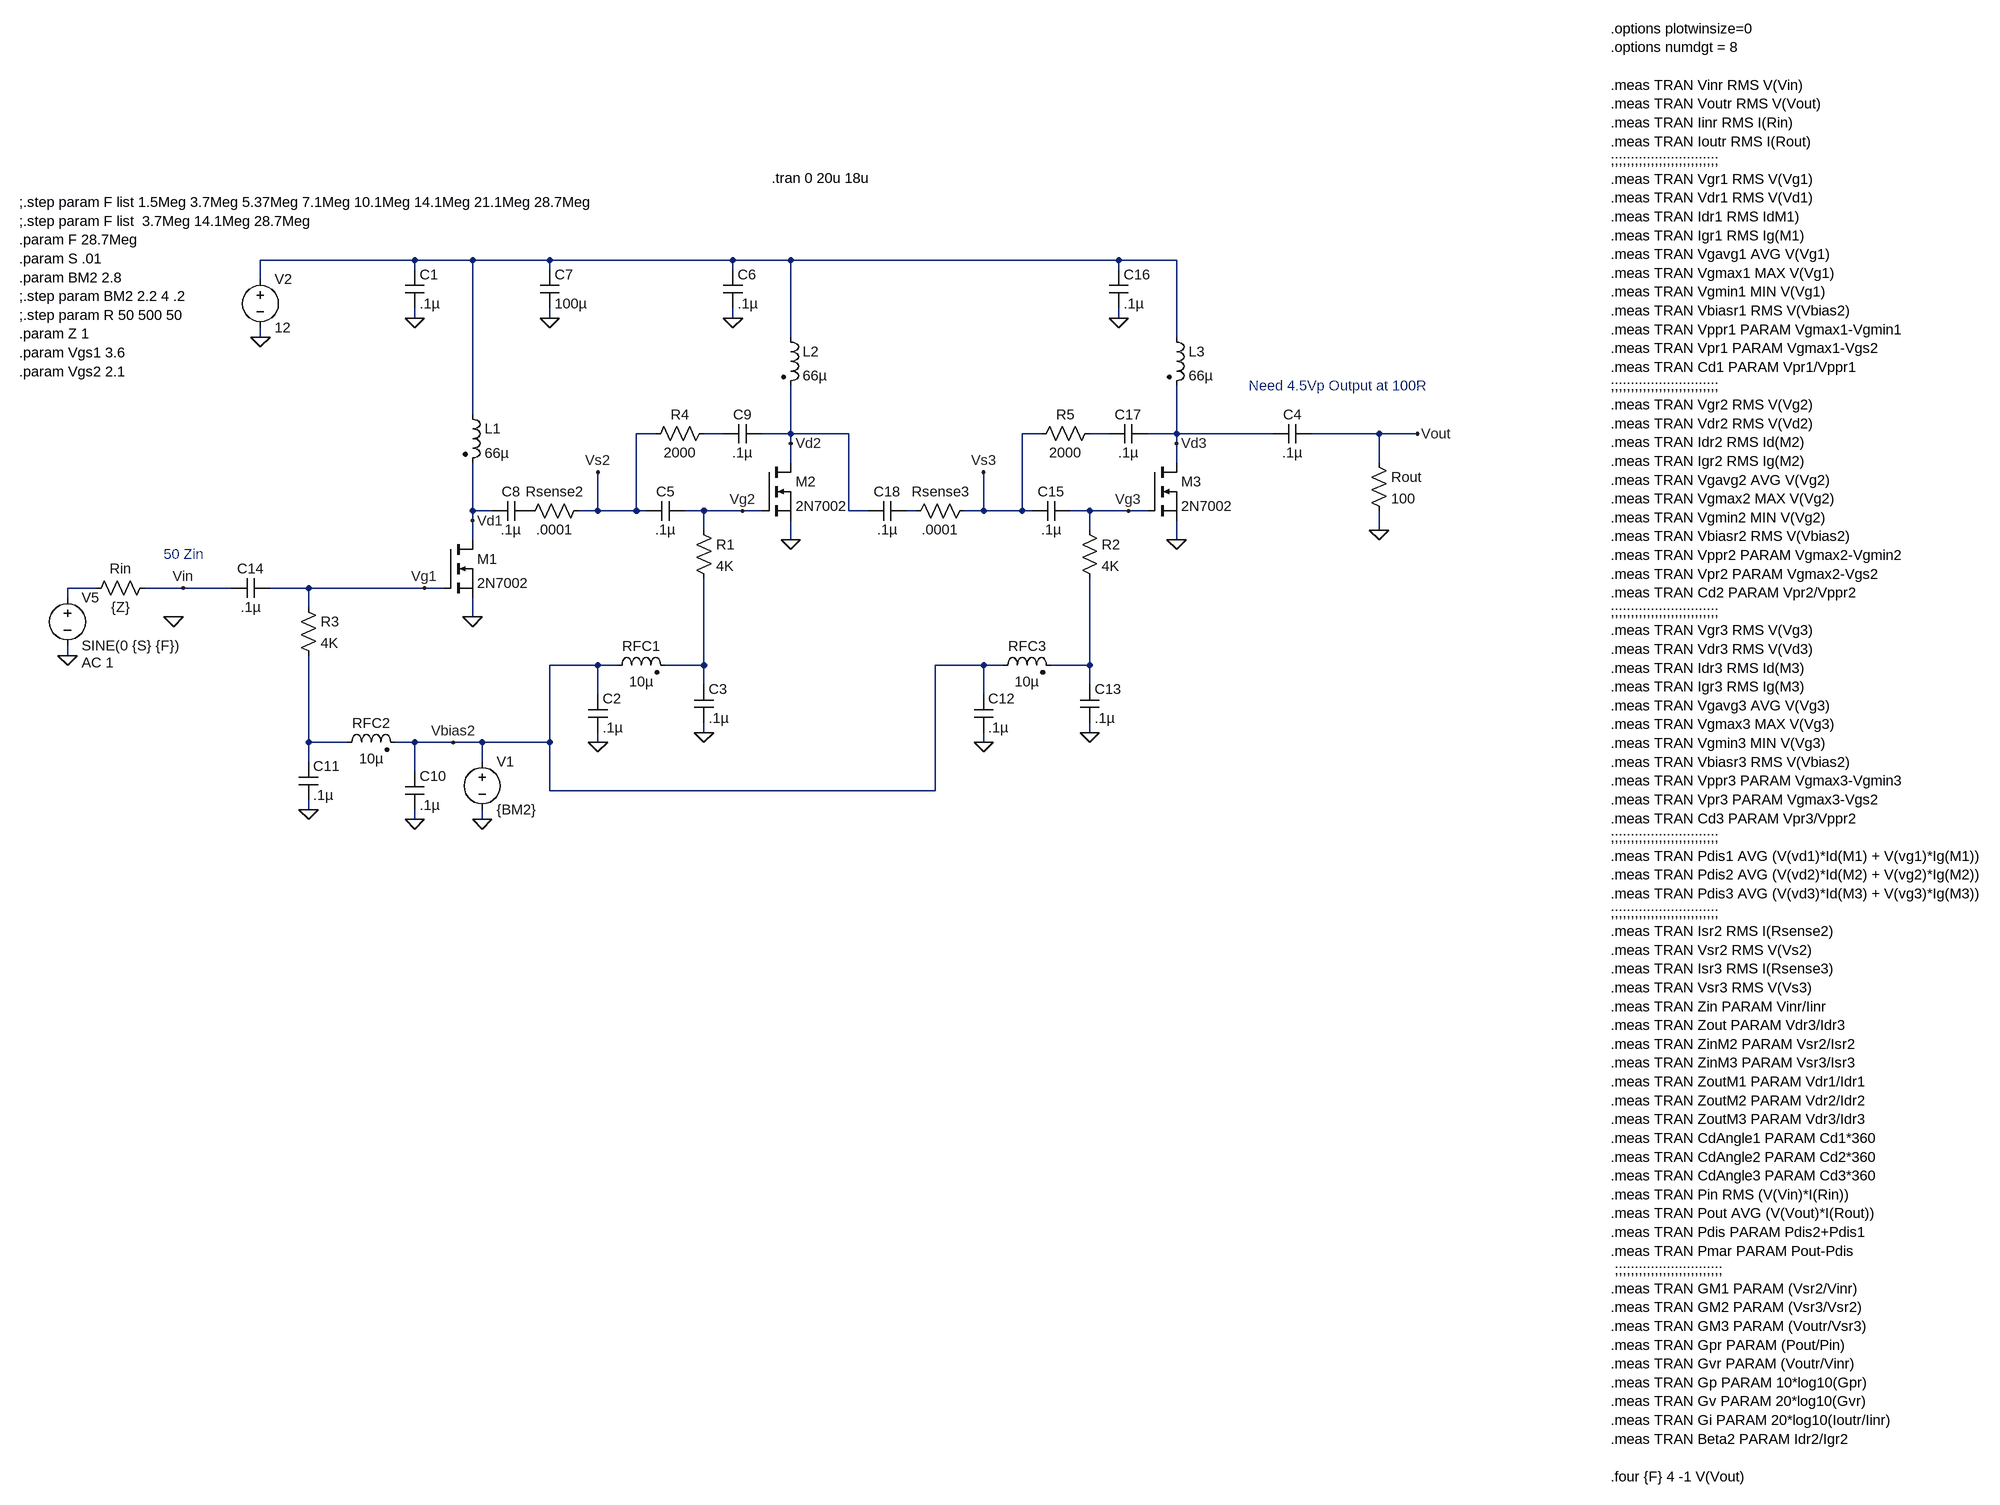
[diagram p0: schematic 2N7000 x3 Pre Amp Testing.asc]
2N7000 x3 Pre Amp Testing.asc, the LTspice schematic file:
Version 4
SHEET 1 4348 1616
WIRE 512 -176 256 -176
WIRE 608 -176 512 -176
WIRE 736 -176 608 -176
WIRE 1040 -176 736 -176
WIRE 1136 -176 1040 -176
WIRE 1680 -176 1136 -176
WIRE 1776 -176 1680 -176
WIRE 512 -160 512 -176
WIRE 736 -160 736 -176
WIRE 1040 -160 1040 -176
WIRE 1680 -160 1680 -176
WIRE 256 -144 256 -176
WIRE 512 -80 512 -96
WIRE 736 -80 736 -96
WIRE 1040 -80 1040 -96
WIRE 1680 -80 1680 -96
WIRE 256 -48 256 -64
WIRE 1136 -48 1136 -176
WIRE 1776 -48 1776 -176
WIRE 608 80 608 -176
WIRE 912 112 880 112
WIRE 1024 112 992 112
WIRE 1136 112 1136 32
WIRE 1136 112 1088 112
WIRE 1232 112 1136 112
WIRE 1552 112 1520 112
WIRE 1664 112 1632 112
WIRE 1776 112 1776 32
WIRE 1776 112 1728 112
WIRE 1936 112 1776 112
WIRE 2112 112 2000 112
WIRE 2176 112 2112 112
WIRE 1136 128 1136 112
WIRE 1776 128 1776 112
WIRE 1136 160 1136 128
WIRE 1776 160 1776 128
WIRE 2112 160 2112 112
WIRE 608 240 608 160
WIRE 640 240 608 240
WIRE 816 240 816 176
WIRE 816 240 784 240
WIRE 880 240 880 112
WIRE 880 240 816 240
WIRE 896 240 880 240
WIRE 992 240 960 240
WIRE 1056 240 992 240
WIRE 1088 240 1056 240
WIRE 1232 240 1232 112
WIRE 1264 240 1232 240
WIRE 1344 240 1328 240
WIRE 1456 240 1456 176
WIRE 1456 240 1424 240
WIRE 1520 240 1520 112
WIRE 1520 240 1456 240
WIRE 1536 240 1520 240
WIRE 1632 240 1600 240
WIRE 1696 240 1632 240
WIRE 1728 240 1696 240
WIRE 608 256 608 240
WIRE 992 272 992 240
WIRE 1632 272 1632 240
WIRE 2112 272 2112 240
WIRE 608 288 608 256
WIRE 1136 288 1136 256
WIRE 1776 288 1776 256
WIRE -16 368 -64 368
WIRE 128 368 64 368
WIRE 208 368 128 368
WIRE 336 368 272 368
WIRE 528 368 336 368
WIRE 560 368 528 368
WIRE -64 384 -64 368
WIRE 336 400 336 368
WIRE 608 416 608 384
WIRE -64 480 -64 464
WIRE 816 496 736 496
WIRE 848 496 816 496
WIRE 992 496 992 352
WIRE 992 496 928 496
WIRE 1456 496 1376 496
WIRE 1488 496 1456 496
WIRE 1632 496 1632 352
WIRE 1632 496 1568 496
WIRE 992 528 992 496
WIRE 1632 528 1632 496
WIRE 816 544 816 496
WIRE 1456 544 1456 496
WIRE 992 608 992 592
WIRE 1632 608 1632 592
WIRE 336 624 336 480
WIRE 400 624 336 624
WIRE 512 624 480 624
WIRE 576 624 512 624
WIRE 624 624 576 624
WIRE 736 624 736 496
WIRE 736 624 624 624
WIRE 816 624 816 608
WIRE 1456 624 1456 608
WIRE 336 656 336 624
WIRE 624 656 624 624
WIRE 512 672 512 624
WIRE 736 704 736 624
WIRE 1376 704 1376 496
WIRE 1376 704 736 704
WIRE 336 736 336 720
WIRE 512 752 512 736
WIRE 624 752 624 736
FLAG 256 -48 0
FLAG 2112 272 0
FLAG 2176 112 Vout
FLAG -64 480 0
FLAG 128 368 Vin
FLAG 608 416 0
FLAG 528 368 Vg1
FLAG 608 256 Vd1
FLAG 512 752 0
FLAG 336 736 0
FLAG 624 752 0
FLAG 576 624 Vbias2
FLAG 112 416 0
FLAG 512 -80 0
FLAG 1136 288 0
FLAG 1056 240 Vg2
FLAG 1136 128 Vd2
FLAG 816 624 0
FLAG 992 608 0
FLAG 1040 -80 0
FLAG 736 -80 0
FLAG 816 176 Vs2
FLAG 1776 288 0
FLAG 1696 240 Vg3
FLAG 1776 128 Vd3
FLAG 1456 624 0
FLAG 1632 608 0
FLAG 1680 -80 0
FLAG 1456 176 Vs3
SYMBOL voltage 256 -160 R0
WINDOW 123 0 0 Left 2
WINDOW 39 0 0 Left 2
SYMATTR InstName V2
SYMATTR Value 12
SYMBOL res 2096 144 R0
SYMATTR InstName Rout
SYMATTR Value 100
SYMBOL voltage -64 368 R0
WINDOW 123 24 124 Left 2
WINDOW 39 24 152 Left 2
SYMATTR Value2 AC 1
SYMATTR InstName V5
SYMATTR Value SINE(0 {S} {F})
SYMBOL res 320 384 R0
SYMATTR InstName R3
SYMATTR Value 4K
SYMBOL cap 1936 128 R270
WINDOW 0 32 32 VTop 2
WINDOW 3 0 32 VBottom 2
SYMATTR InstName C4
SYMATTR Value .1µ
SYMBOL ind2 384 640 R270
WINDOW 0 32 56 VTop 2
WINDOW 3 4 56 VBottom 2
SYMATTR InstName RFC2
SYMATTR Value 10µ
SYMATTR Type ind
SYMBOL cap 496 672 R0
SYMATTR InstName C10
SYMATTR Value .1µ
SYMBOL cap 320 656 R0
SYMATTR InstName C11
SYMATTR Value .1µ
SYMBOL voltage 624 640 R0
WINDOW 123 0 0 Left 2
WINDOW 39 0 0 Left 2
SYMATTR InstName V1
SYMATTR Value {BM2}
SYMBOL ind2 592 64 R0
SYMATTR InstName L1
SYMATTR Value 66µ
SYMATTR Type ind
SYMBOL cap 208 384 R270
WINDOW 0 32 32 VTop 2
WINDOW 3 0 32 VBottom 2
SYMATTR InstName C14
SYMATTR Value .1µ
SYMBOL cap 496 -160 R0
SYMATTR InstName C1
SYMATTR Value .1µ
SYMBOL res 976 256 R0
SYMATTR InstName R1
SYMATTR Value 4K
SYMBOL ind2 832 512 R270
WINDOW 0 32 56 VTop 2
WINDOW 3 4 56 VBottom 2
SYMATTR InstName RFC1
SYMATTR Value 10µ
SYMATTR Type ind
SYMBOL cap 800 544 R0
SYMATTR InstName C2
SYMATTR Value .1µ
SYMBOL cap 976 528 R0
SYMATTR InstName C3
SYMATTR Value .1µ
SYMBOL ind2 1120 -64 R0
SYMATTR InstName L2
SYMATTR Value 66µ
SYMATTR Type ind
SYMBOL cap 896 256 R270
WINDOW 0 32 32 VTop 2
WINDOW 3 0 32 VBottom 2
SYMATTR InstName C5
SYMATTR Value .1µ
SYMBOL cap 1024 -160 R0
SYMATTR InstName C6
SYMATTR Value .1µ
SYMBOL cap 720 -160 R0
SYMATTR InstName C7
SYMATTR Value 100µ
SYMBOL cap 640 256 R270
WINDOW 0 32 32 VTop 2
WINDOW 3 0 32 VBottom 2
SYMATTR InstName C8
SYMATTR Value .1µ
SYMBOL res 800 224 R90
WINDOW 0 0 56 VBottom 2
WINDOW 3 32 56 VTop 2
SYMATTR InstName Rsense2
SYMATTR Value .0001
SYMBOL res 80 352 R90
WINDOW 0 0 56 VBottom 2
WINDOW 3 32 56 VTop 2
SYMATTR InstName Rin
SYMATTR Value {Z}
SYMBOL res 1616 256 R0
SYMATTR InstName R2
SYMATTR Value 4K
SYMBOL ind2 1472 512 R270
WINDOW 0 32 56 VTop 2
WINDOW 3 4 56 VBottom 2
SYMATTR InstName RFC3
SYMATTR Value 10µ
SYMATTR Type ind
SYMBOL cap 1440 544 R0
SYMATTR InstName C12
SYMATTR Value .1µ
SYMBOL cap 1616 528 R0
SYMATTR InstName C13
SYMATTR Value .1µ
SYMBOL ind2 1760 -64 R0
SYMATTR InstName L3
SYMATTR Value 66µ
SYMATTR Type ind
SYMBOL cap 1536 256 R270
WINDOW 0 32 32 VTop 2
WINDOW 3 0 32 VBottom 2
SYMATTR InstName C15
SYMATTR Value .1µ
SYMBOL cap 1664 -160 R0
SYMATTR InstName C16
SYMATTR Value .1µ
SYMBOL cap 1264 256 R270
WINDOW 0 32 32 VTop 2
WINDOW 3 0 32 VBottom 2
SYMATTR InstName C18
SYMATTR Value .1µ
SYMBOL res 1440 224 R90
WINDOW 0 0 56 VBottom 2
WINDOW 3 32 56 VTop 2
SYMATTR InstName Rsense3
SYMATTR Value .0001
SYMBOL cap 1088 96 R90
WINDOW 0 0 32 VBottom 2
WINDOW 3 32 32 VTop 2
SYMATTR InstName C9
SYMATTR Value .1µ
SYMBOL res 1008 96 R90
WINDOW 0 0 56 VBottom 2
WINDOW 3 32 56 VTop 2
SYMATTR InstName R4
SYMATTR Value 2000
SYMBOL cap 1728 96 R90
WINDOW 0 0 32 VBottom 2
WINDOW 3 32 32 VTop 2
SYMATTR InstName C17
SYMATTR Value .1µ
SYMBOL res 1648 96 R90
WINDOW 0 0 56 VBottom 2
WINDOW 3 32 56 VTop 2
SYMATTR InstName R5
SYMATTR Value 2000
SYMBOL nmos 560 288 R0
SYMATTR InstName M1
SYMATTR Value 2N7002
SYMBOL nmos 1088 160 R0
SYMATTR InstName M2
SYMATTR Value 2N7002
SYMBOL nmos 1728 160 R0
SYMATTR InstName M3
SYMATTR Value 2N7002
TEXT 2496 -560 Left 2 !.options plotwinsize=0\n.options numdgt = 8\n \n.meas TRAN Vinr RMS V(Vin)\n.meas TRAN Voutr RMS V(Vout)\n.meas TRAN Iinr RMS I(Rin)\n.meas TRAN Ioutr RMS I(Rout)\n;;;;;;;;;;;;;;;;;;;;;;;;;;;\n.meas TRAN Vgr1 RMS V(Vg1)\n.meas TRAN Vdr1 RMS V(Vd1)\n.meas TRAN Idr1 RMS IdM1)\n.meas TRAN Igr1 RMS Ig(M1)\n.meas TRAN Vgavg1 AVG V(Vg1)\n.meas TRAN Vgmax1 MAX V(Vg1)\n.meas TRAN Vgmin1 MIN V(Vg1)\n.meas TRAN Vbiasr1 RMS V(Vbias2)\n.meas TRAN Vppr1 PARAM Vgmax1-Vgmin1\n.meas TRAN Vpr1 PARAM Vgmax1-Vgs2\n.meas TRAN Cd1 PARAM Vpr1/Vppr1\n;;;;;;;;;;;;;;;;;;;;;;;;;;;\n.meas TRAN Vgr2 RMS V(Vg2)\n.meas TRAN Vdr2 RMS V(Vd2)\n.meas TRAN Idr2 RMS Id(M2)\n.meas TRAN Igr2 RMS Ig(M2)\n.meas TRAN Vgavg2 AVG V(Vg2)\n.meas TRAN Vgmax2 MAX V(Vg2)\n.meas TRAN Vgmin2 MIN V(Vg2)\n.meas TRAN Vbiasr2 RMS V(Vbias2)\n.meas TRAN Vppr2 PARAM Vgmax2-Vgmin2\n.meas TRAN Vpr2 PARAM Vgmax2-Vgs2\n.meas TRAN Cd2 PARAM Vpr2/Vppr2\n;;;;;;;;;;;;;;;;;;;;;;;;;;;\n.meas TRAN Vgr3 RMS V(Vg3)\n.meas TRAN Vdr3 RMS V(Vd3)\n.meas TRAN Idr3 RMS Id(M3)\n.meas TRAN Igr3 RMS Ig(M3)\n.meas TRAN Vgavg3 AVG V(Vg3)\n.meas TRAN Vgmax3 MAX V(Vg3)\n.meas TRAN Vgmin3 MIN V(Vg3)\n.meas TRAN Vbiasr3 RMS V(Vbias2)\n.meas TRAN Vppr3 PARAM Vgmax3-Vgmin3\n.meas TRAN Vpr3 PARAM Vgmax3-Vgs2\n.meas TRAN Cd3 PARAM Vpr3/Vppr2\n;;;;;;;;;;;;;;;;;;;;;;;;;;;\n.meas TRAN Pdis1 AVG (V(vd1)*Id(M1) + V(vg1)*Ig(M1))\n.meas TRAN Pdis2 AVG (V(vd2)*Id(M2) + V(vg2)*Ig(M2))\n.meas TRAN Pdis3 AVG (V(vd3)*Id(M3) + V(vg3)*Ig(M3))\n;;;;;;;;;;;;;;;;;;;;;;;;;;;\n.meas TRAN Isr2 RMS I(Rsense2)\n.meas TRAN Vsr2 RMS V(Vs2)\n.meas TRAN Isr3 RMS I(Rsense3)\n.meas TRAN Vsr3 RMS V(Vs3)\n.meas TRAN Zin PARAM Vinr/Iinr\n.meas TRAN Zout PARAM Vdr3/Idr3\n.meas TRAN ZinM2 PARAM Vsr2/Isr2\n.meas TRAN ZinM3 PARAM Vsr3/Isr3\n.meas TRAN ZoutM1 PARAM Vdr1/Idr1\n.meas TRAN ZoutM2 PARAM Vdr2/Idr2\n.meas TRAN ZoutM3 PARAM Vdr3/Idr3\n.meas TRAN CdAngle1 PARAM Cd1*360\n.meas TRAN CdAngle2 PARAM Cd2*360\n.meas TRAN CdAngle3 PARAM Cd3*360\n.meas TRAN Pin RMS (V(Vin)*I(Rin))\n.meas TRAN Pout AVG (V(Vout)*I(Rout))\n.meas TRAN Pdis PARAM Pdis2+Pdis1\n.meas TRAN Pmar PARAM Pout-Pdis\n ;;;;;;;;;;;;;;;;;;;;;;;;;;;\n.meas TRAN GM1 PARAM (Vsr2/Vinr)\n.meas TRAN GM2 PARAM (Vsr3/Vsr2)\n.meas TRAN GM3 PARAM (Voutr/Vsr3)\n.meas TRAN Gpr PARAM (Pout/Pin)\n.meas TRAN Gvr PARAM (Voutr/Vinr)\n.meas TRAN Gp PARAM 10*log10(Gpr)\n.meas TRAN Gv PARAM 20*log10(Gvr)\n.meas TRAN Gi PARAM 20*log10(Ioutr/Iinr)\n.meas TRAN Beta2 PARAM Idr2/Igr2\n \n.four {F} 4 -1 V(Vout)
TEXT -144 -272 Left 2 !;.step param F list 1.5Meg 3.7Meg 5.37Meg 7.1Meg 10.1Meg 14.1Meg 21.1Meg 28.7Meg\n;.step param F list  3.7Meg 14.1Meg 28.7Meg\n.param F 28.7Meg\n.param S .01\n.param BM2 2.8\n;.step param BM2 2.2 4 .2\n;.step param R 50 500 50\n.param Z 1\n.param Vgs1 3.6\n.param Vgs2 2.1
TEXT 1896 32 Left 2 ;Need 4.5Vp Output at 100R
TEXT 96 312 Left 2 ;50 Zin
TEXT 1104 -312 Left 2 !.tran 0 20u 18u

The netlist it stands for:
* 2N7000 x3 Pre Amp Testing.asc
V2 N001 0 12
Rout Vout 0 100
V5 N005 0 SINE(0 {S} {F}) AC 1
R3 Vg1 N008 4K
C4 Vd3 Vout .1µ
L§RFC2 N008 Vbias2 10µ
C10 Vbias2 0 .1µ
C11 N008 0 .1µ
V1 Vbias2 0 {BM2}
L1 N001 Vd1 66µ
C14 Vin Vg1 .1µ
C1 N001 0 .1µ
R1 Vg2 N006 4K
L§RFC1 Vbias2 N006 10µ
C2 Vbias2 0 .1µ
C3 N006 0 .1µ
L2 N001 Vd2 66µ
C5 Vs2 Vg2 .1µ
C6 N001 0 .1µ
C7 N001 0 100µ
C8 Vd1 P001 .1µ
Rsense2 Vs2 P001 .0001
Rin Vin N005 {Z}
R2 Vg3 N007 4K
L§RFC3 Vbias2 N007 10µ
C12 Vbias2 0 .1µ
C13 N007 0 .1µ
L3 N001 Vd3 66µ
C15 Vs3 Vg3 .1µ
C16 N001 0 .1µ
C18 Vd2 N004 .1µ
Rsense3 Vs3 N004 .0001
C9 Vd2 N002 .1µ
R4 N002 Vs2 2000
C17 Vd3 N003 .1µ
R5 N003 Vs3 2000
M1 Vd1 Vg1 0 0 2N7002
M2 Vd2 Vg2 0 0 2N7002
M3 Vd3 Vg3 0 0 2N7002
.model NMOS NMOS
.model PMOS PMOS
.lib standard.mos
.options plotwinsize=0
.options numdgt = 8
.meas TRAN Vinr RMS V(Vin)
.meas TRAN Voutr RMS V(Vout)
.meas TRAN Iinr RMS I(Rin)
.meas TRAN Ioutr RMS I(Rout)
;;;;;;;;;;;;;;;;;;;;;;;;;;;
.meas TRAN Vgr1 RMS V(Vg1)
.meas TRAN Vdr1 RMS V(Vd1)
.meas TRAN Idr1 RMS IdM1)
.meas TRAN Igr1 RMS Ig(M1)
.meas TRAN Vgavg1 AVG V(Vg1)
.meas TRAN Vgmax1 MAX V(Vg1)
.meas TRAN Vgmin1 MIN V(Vg1)
.meas TRAN Vbiasr1 RMS V(Vbias2)
.meas TRAN Vppr1 PARAM Vgmax1-Vgmin1
.meas TRAN Vpr1 PARAM Vgmax1-Vgs2
.meas TRAN Cd1 PARAM Vpr1/Vppr1
;;;;;;;;;;;;;;;;;;;;;;;;;;;
.meas TRAN Vgr2 RMS V(Vg2)
.meas TRAN Vdr2 RMS V(Vd2)
.meas TRAN Idr2 RMS Id(M2)
.meas TRAN Igr2 RMS Ig(M2)
.meas TRAN Vgavg2 AVG V(Vg2)
.meas TRAN Vgmax2 MAX V(Vg2)
.meas TRAN Vgmin2 MIN V(Vg2)
.meas TRAN Vbiasr2 RMS V(Vbias2)
.meas TRAN Vppr2 PARAM Vgmax2-Vgmin2
.meas TRAN Vpr2 PARAM Vgmax2-Vgs2
.meas TRAN Cd2 PARAM Vpr2/Vppr2
;;;;;;;;;;;;;;;;;;;;;;;;;;;
.meas TRAN Vgr3 RMS V(Vg3)
.meas TRAN Vdr3 RMS V(Vd3)
.meas TRAN Idr3 RMS Id(M3)
.meas TRAN Igr3 RMS Ig(M3)
.meas TRAN Vgavg3 AVG V(Vg3)
.meas TRAN Vgmax3 MAX V(Vg3)
.meas TRAN Vgmin3 MIN V(Vg3)
.meas TRAN Vbiasr3 RMS V(Vbias2)
.meas TRAN Vppr3 PARAM Vgmax3-Vgmin3
.meas TRAN Vpr3 PARAM Vgmax3-Vgs2
.meas TRAN Cd3 PARAM Vpr3/Vppr2
;;;;;;;;;;;;;;;;;;;;;;;;;;;
.meas TRAN Pdis1 AVG (V(vd1)*Id(M1) + V(vg1)*Ig(M1))
.meas TRAN Pdis2 AVG (V(vd2)*Id(M2) + V(vg2)*Ig(M2))
.meas TRAN Pdis3 AVG (V(vd3)*Id(M3) + V(vg3)*Ig(M3))
;;;;;;;;;;;;;;;;;;;;;;;;;;;
.meas TRAN Isr2 RMS I(Rsense2)
.meas TRAN Vsr2 RMS V(Vs2)
.meas TRAN Isr3 RMS I(Rsense3)
.meas TRAN Vsr3 RMS V(Vs3)
.meas TRAN Zin PARAM Vinr/Iinr
.meas TRAN Zout PARAM Vdr3/Idr3
.meas TRAN ZinM2 PARAM Vsr2/Isr2
.meas TRAN ZinM3 PARAM Vsr3/Isr3
.meas TRAN ZoutM1 PARAM Vdr1/Idr1
.meas TRAN ZoutM2 PARAM Vdr2/Idr2
.meas TRAN ZoutM3 PARAM Vdr3/Idr3
.meas TRAN CdAngle1 PARAM Cd1*360
.meas TRAN CdAngle2 PARAM Cd2*360
.meas TRAN CdAngle3 PARAM Cd3*360
.meas TRAN Pin RMS (V(Vin)*I(Rin))
.meas TRAN Pout AVG (V(Vout)*I(Rout))
.meas TRAN Pdis PARAM Pdis2+Pdis1
.meas TRAN Pmar PARAM Pout-Pdis
 ;;;;;;;;;;;;;;;;;;;;;;;;;;;
.meas TRAN GM1 PARAM (Vsr2/Vinr)
.meas TRAN GM2 PARAM (Vsr3/Vsr2)
.meas TRAN GM3 PARAM (Voutr/Vsr3)
.meas TRAN Gpr PARAM (Pout/Pin)
.meas TRAN Gvr PARAM (Voutr/Vinr)
.meas TRAN Gp PARAM 10*log10(Gpr)
.meas TRAN Gv PARAM 20*log10(Gvr)
.meas TRAN Gi PARAM 20*log10(Ioutr/Iinr)
.meas TRAN Beta2 PARAM Idr2/Igr2
.four {F} 4 -1 V(Vout)
;.step param F list 1.5Meg 3.7Meg 5.37Meg 7.1Meg 10.1Meg 14.1Meg 21.1Meg 28.7Meg
;.step param F list  3.7Meg 14.1Meg 28.7Meg
.param F 28.7Meg
.param S .01
.param BM2 2.8
;.step param BM2 2.2 4 .2
;.step param R 50 500 50
.param Z 1
.param Vgs1 3.6
.param Vgs2 2.1
* Need 4.5Vp Output at 100R
* 50 Zin
.tran 0 20u 18u
.backanno
.end